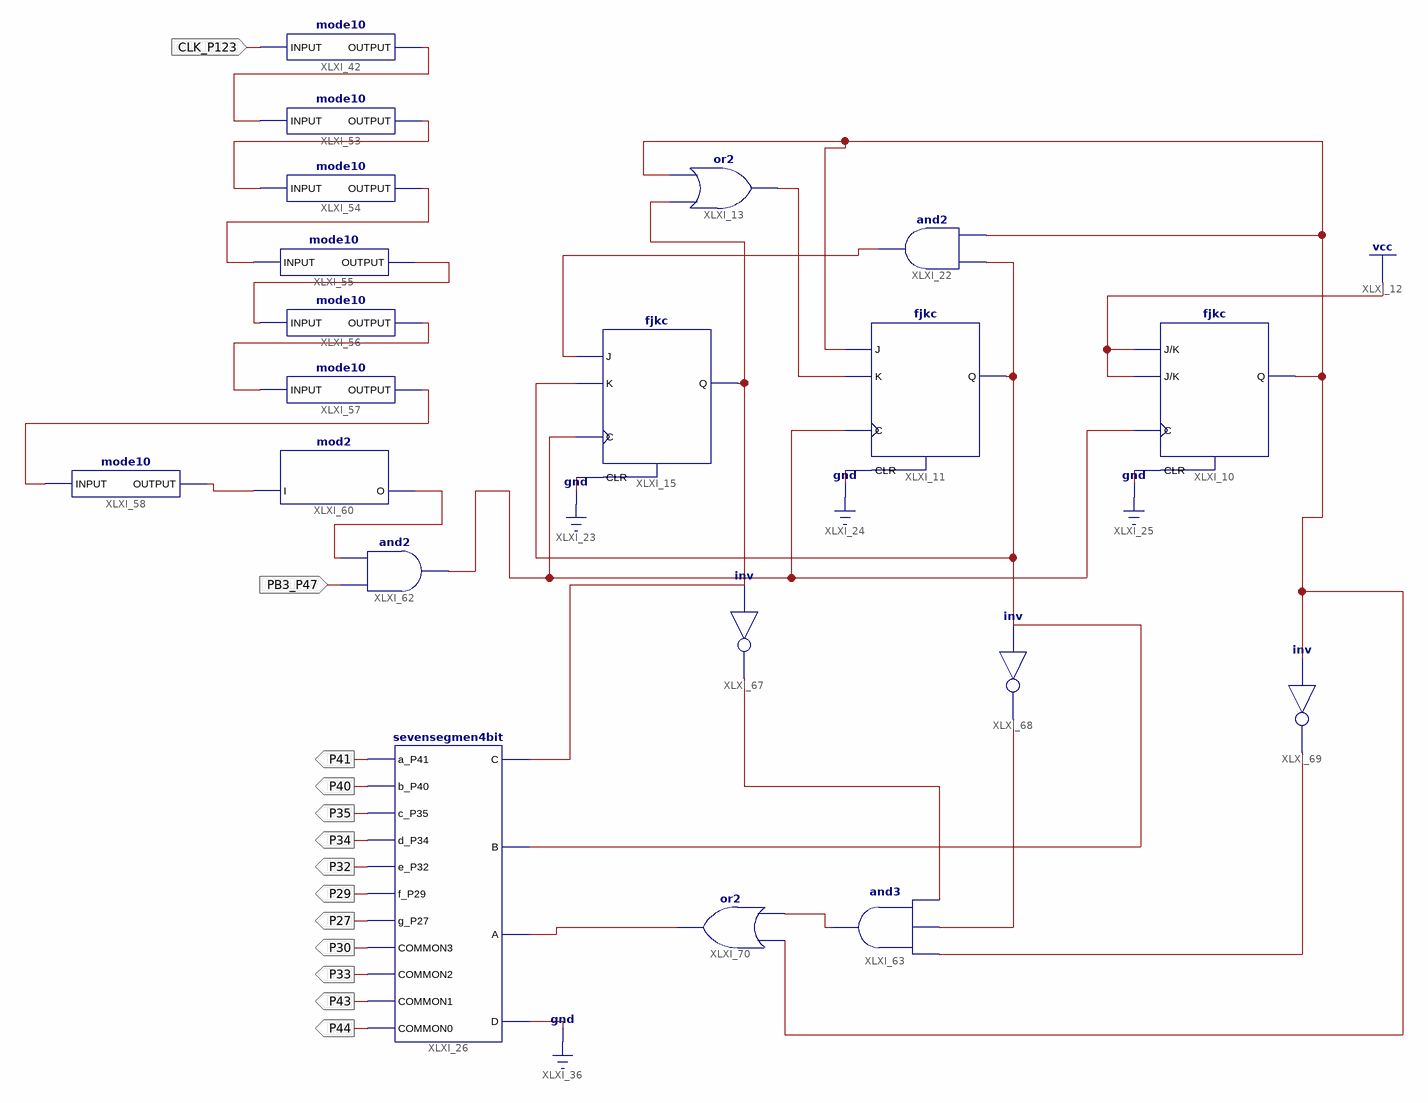
[diagram p0: schematic sheet 1]
// Xilinx ISE schematic Lab5.sch (spartan6) as structural Verilog: 20 symbols, 13 ports
module Lab5 (
  input  PB3_P47,
  input  CLK_P123,
  output P41,
  output P40,
  output P35,
  output P34,
  output P32,
  output P29,
  output P27,
  output P30,
  output P33,
  output P43,
  output P44
);

  wire L0_P82, L1_P81, L2_P80, XLXN_23, XLXN_25, XLXN_90, XLXN_91, XLXN_92, XLXN_93, XLXN_94, XLXN_97,
       XLXN_99, XLXN_108, XLXN_109, XLXN_111, XLXN_112, XLXN_113, XLXN_114, XLXN_120;

  fjkc XLXI_10 (.C(XLXN_109), .CLR(1'b0), .J(1'b1), .K(1'b1), .Q(XLXN_120));
  fjkc XLXI_11 (.C(XLXN_109), .CLR(1'b0), .J(XLXN_120), .K(XLXN_23), .Q(L1_P81));
  or XLXI_13 (XLXN_23, L2_P80, XLXN_120);
  fjkc XLXI_15 (.C(XLXN_109), .CLR(1'b0), .J(XLXN_25), .K(L1_P81), .Q(L2_P80));
  and XLXI_22 (XLXN_25, L1_P81, XLXN_120);
  sevensegmen4bit XLXI_26 (
    .C(L2_P80), .B(L1_P81), .A(L0_P82), .D(1'b0), .a_P41(P41), .b_P40(P40), .c_P35(P35), .d_P34(P34),
    .e_P32(P32), .f_P29(P29), .g_P27(P27), .COMMON3(P30), .COMMON2(P33), .COMMON1(P43), .COMMON0(P44));
  mode10 XLXI_42 (.INPUT(CLK_P123), .OUTPUT(XLXN_90));
  mode10 XLXI_53 (.INPUT(XLXN_90), .OUTPUT(XLXN_91));
  mode10 XLXI_54 (.INPUT(XLXN_91), .OUTPUT(XLXN_92));
  mode10 XLXI_55 (.INPUT(XLXN_92), .OUTPUT(XLXN_93));
  mode10 XLXI_56 (.INPUT(XLXN_93), .OUTPUT(XLXN_94));
  mode10 XLXI_57 (.INPUT(XLXN_94), .OUTPUT(XLXN_97));
  mode10 XLXI_58 (.INPUT(XLXN_97), .OUTPUT(XLXN_99));
  mod2 XLXI_60 (.I(XLXN_99), .O(XLXN_108));
  and XLXI_62 (XLXN_109, PB3_P47, XLXN_108);
  and XLXI_63 (XLXN_114, XLXN_111, XLXN_112, XLXN_113);
  not XLXI_67 (XLXN_111, L2_P80);
  not XLXI_68 (XLXN_112, L1_P81);
  not XLXI_69 (XLXN_113, XLXN_120);
  or XLXI_70 (L0_P82, XLXN_114, XLXN_120);
endmodule
